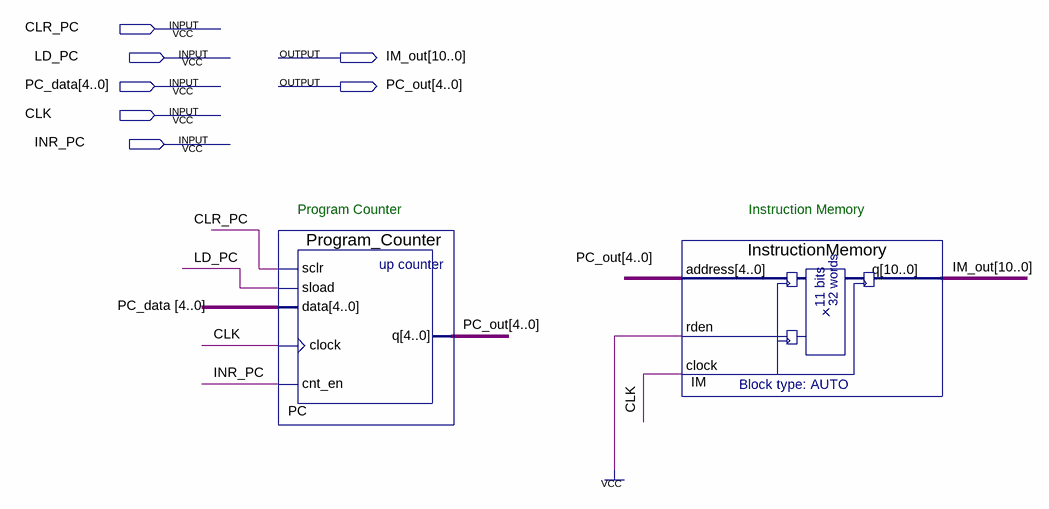
[diagram p0: schematic sheet]
// Quartus schematic 2019510083_Ata_Can_Yaymaci_IMU.bdf as structural Verilog: 2 symbols, 7 pins
module \2019510083_Ata_Can_Yaymaci_IMU  (
  input  CLR_PC,
  input  LD_PC,
  input  [4:0] PC_data,
  input  CLK,
  input  INR_PC,
  output [10:0] IM_out,
  output [4:0] PC_out
);

  Program_Counter PC (.sclr(CLR_PC), .sload(LD_PC), .data(PC_data), .clock(CLK), .cnt_en(INR_PC), .q(PC_out));
  InstructionMemory IM (.address(PC_out), .rden(1'b1), .clock(CLK), .q(IM_out));

  // Notes on the sheet:
  //   Program Counter
  //   Instruction Memory
endmodule
